# EAGLE schematic BoardBase (EAGLE 7.6.0)
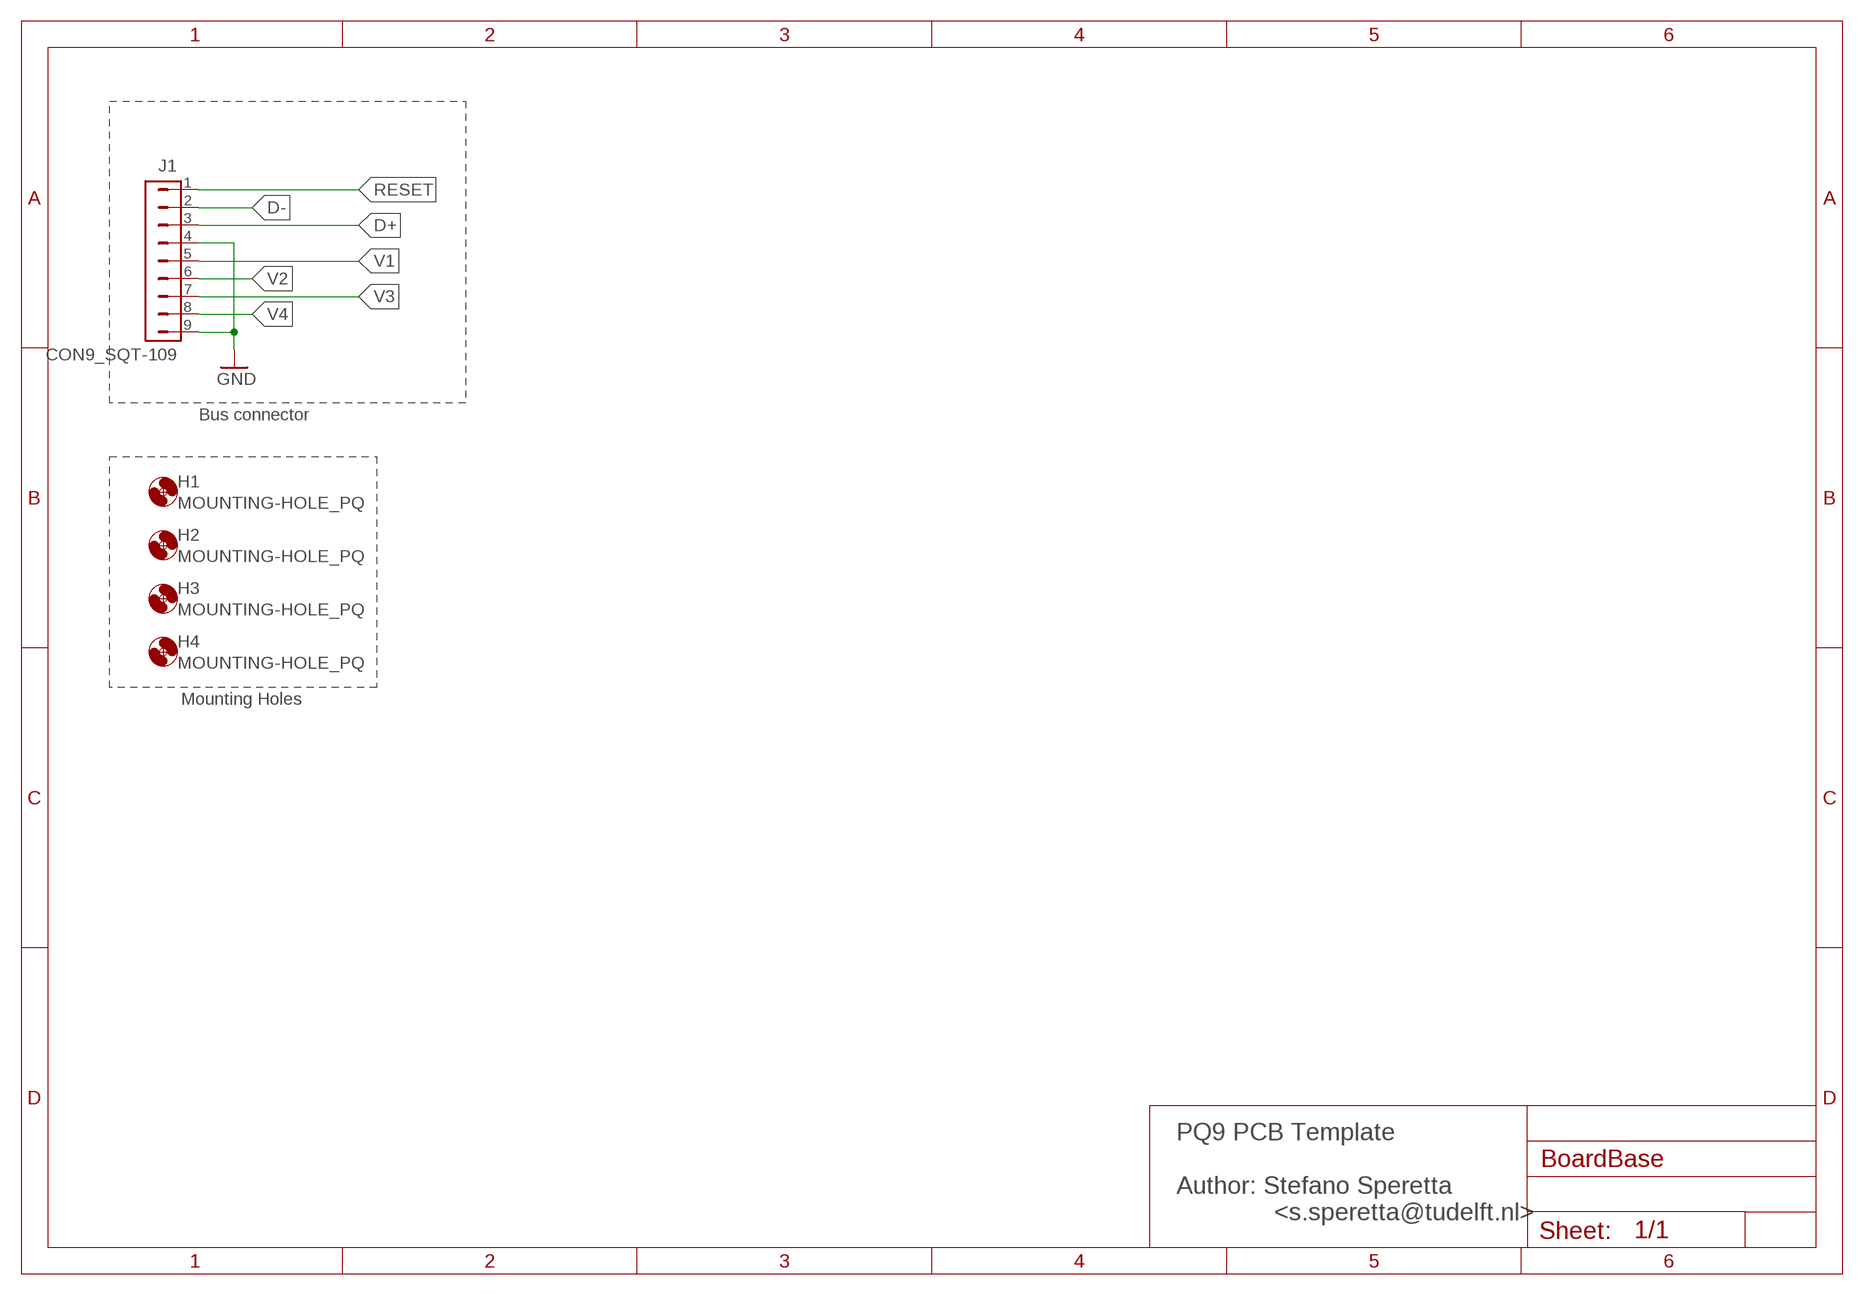
[diagram p0: schematic, sheet 1]

## Parts
H1  MOUNTING-HOLE_PQ  [MOUNTING-HOLE-PQ]
H2  MOUNTING-HOLE_PQ  [MOUNTING-HOLE-PQ]
H3  MOUNTING-HOLE_PQ  [MOUNTING-HOLE-PQ]
H4  MOUNTING-HOLE_PQ  [MOUNTING-HOLE-PQ]
J1  CON9_SQT-109  [SQT-109]

## Nets
D+: J1.3
D-: J1.2
GND: J1.4 J1.9
RESET: J1.1
V1: J1.5
V2: J1.6
V3: J1.7
V4: J1.8

## Notes on the sheet
- Bus connector
- Mounting Holes
- PQ9 PCB Template
  
  Author: Stefano Speretta
                <s.speretta@tudelft.nl>

## Library data of the parts
H1-H4 = Delfi-PQ:MOUNTING-HOLE: Mounting hole device; HEIGHT: 7.0
J1 = Delfi-PQ:CON9: 9 PINS 2MM SINGLE ROW SOCKET STRIP ASSEMBLY.; HEIGHT: 7.0

## Net classes
1 power: width 1 mm, drill 0.6 mm, clearance 0.3 mm